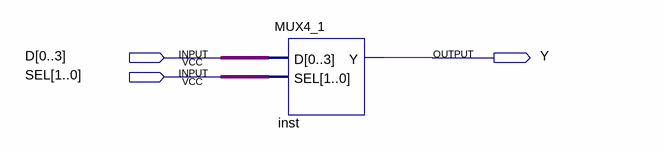
[diagram p0: schematic sheet]
// Quartus schematic lab4-mux4_1.bdf as structural Verilog: 1 symbols, 3 pins
module \lab4-mux4_1  (
  input  [0:3] D,
  input  [1:0] SEL,
  output Y
);

  MUX4_1 inst (.D(D), .SEL(SEL), .Y(Y));
endmodule
